# EAGLE design pripravek (EAGLE 7.2.0)
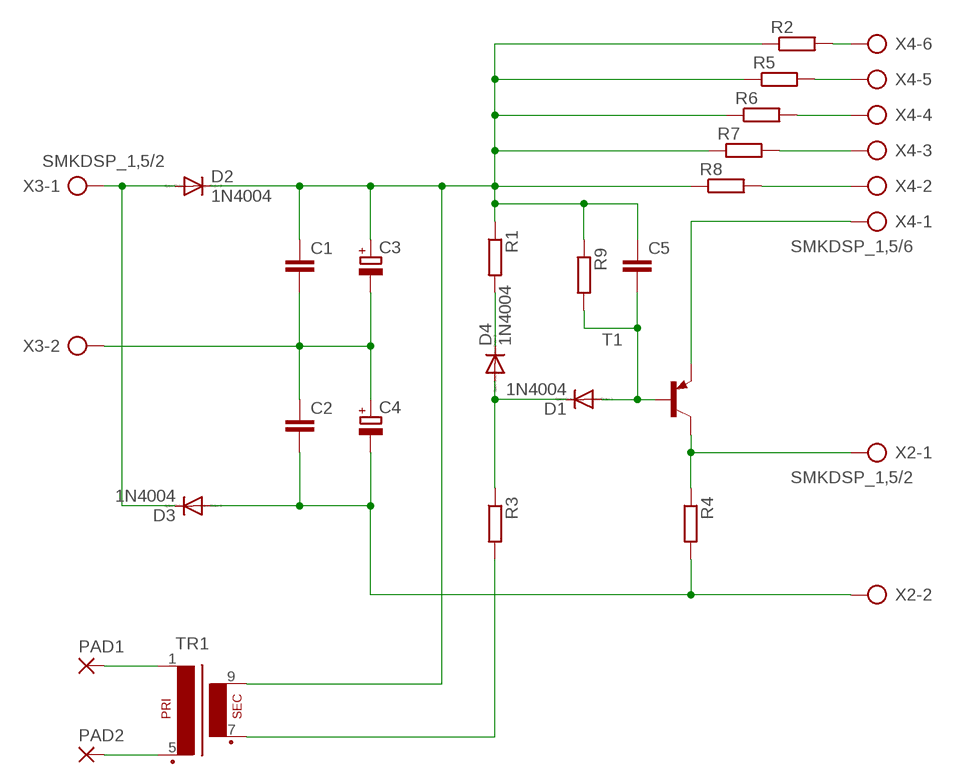
[diagram p0: schematic, sheet 1]

## Parts
C1  C-EU050-035X075  [C050-035X075]
C2  C-EU050-035X075  [C050-035X075]
C3  CPOL-EUE5-8.5  [E5-8,5]
C4  CPOL-EUE5-8.5  [E5-8,5]
C5  C-EU050-035X075  [C050-035X075]
D1  1N4004  [DO41-10]
D2  1N4004  [DO41-10]
D3  1N4004  [DO41-10]
D4  1N4004  [DO41-10]
PAD1  3,81/1,3  [3,81/1,3]
PAD2  3,81/1,3  [3,81/1,3]
R1  R-EU_0207/12  [0207/12]
R2  R-EU_0411/15  [0411/15]
R3  R-EU_0207/12  [0207/12]
R4  R-EU_0207/12  [0207/12]
R5  R-EU_0411/15  [0411/15]
R6  R-EU_0411/15  [0411/15]
R7  R-EU_0411/15  [0411/15]
R8  R-EU_0411/15  [0411/15]
R9  R-EU_0207/12  [0207/12]
T1  -PNP-TO220V  [TO220V]
TR1  EI30-1  [EI30-1]
X2  SMKDSP_1,5/2  [SMKDSP_1,5/2]
X3  SMKDSP_1,5/2  [SMKDSP_1,5/2]
X4  SMKDSP_1,5/6  [SMKDSP_1,5/6]

## Nets
BASE: C5.2 D1.A R9.2 T1.1(B)
COLECTOR: R4.1 T1.2(C) X2.1
EMITER: T1.3(E) X4.1
N$1: PAD1.1(P) TR1.1
N$2: PAD2.1(P) TR1.5(P2)
N$3: R2.2 X4.6
N$4: D1.C D4.A R3.1
N$5: C1.2 C2.1 C3.- C4.+ X3.2
N$6: D4.C R1.2
N$7: D2.A D3.C X3.1
N$8: C2.2 C4.- D3.A R4.2 X2.2
N$10: R3.2 TR1.7(S3)
N$12: R5.2 X4.5
N$13: C1.1 C3.+ C5.1 D2.C R1.1 R2.1 R5.1 R6.1 R7.1 R8.1 R9.1 TR1.9(S4)
N$14: R6.2 X4.4
N$15: R7.2 X4.3
N$16: R8.2 X4.2

## Library data of the parts
C1 C2 C5 = rcl:C-EU: CAPACITOR, European symbol
C3 C4 = rcl:CPOL-EU: POLARIZED CAPACITOR, European symbol
D1-D4 = diode:1N4004: DIODE general purpose rectifier, 1 A
PAD1 PAD2 = wirepad:3,81/1,3: THROUGH-HOLE PAD
R1-R9 = rcl:R-EU_: RESISTOR, European symbol
T1 = transistor:*-PNP-: PNP Transistror
TR1 = trafo:EI30-1: TRANSFORMER 1 primary winding, 1 secondary winding ERA
X2 X3 = con-phoenix-smkdsp:SMKDSP_1,5/2: Printklemme, Nennstrom: 17,5 A, Bemessungsspannung: 250 V, Raster: 5,0 mm Source: http://eshop.phoenixcontact.de .. 1733415.pdf; MF: FARNELL; MPN: 1733570; OC_FARNELL: 3041244; OC_NEWARK: 69C8588
X4 = con-phoenix-smkdsp:SMKDSP_1,5/6: Printklemme, Nennstrom: 17,5 A, Bemessungsspannung: 250 V, Raster: 5,0 mm Source: http://eshop.phoenixcontact.de .. 1733415.pdf; MF: FARNELL; MPN: 1733619; OC_FARNELL: 3041270; OC_NEWARK: 71C4132

## Board
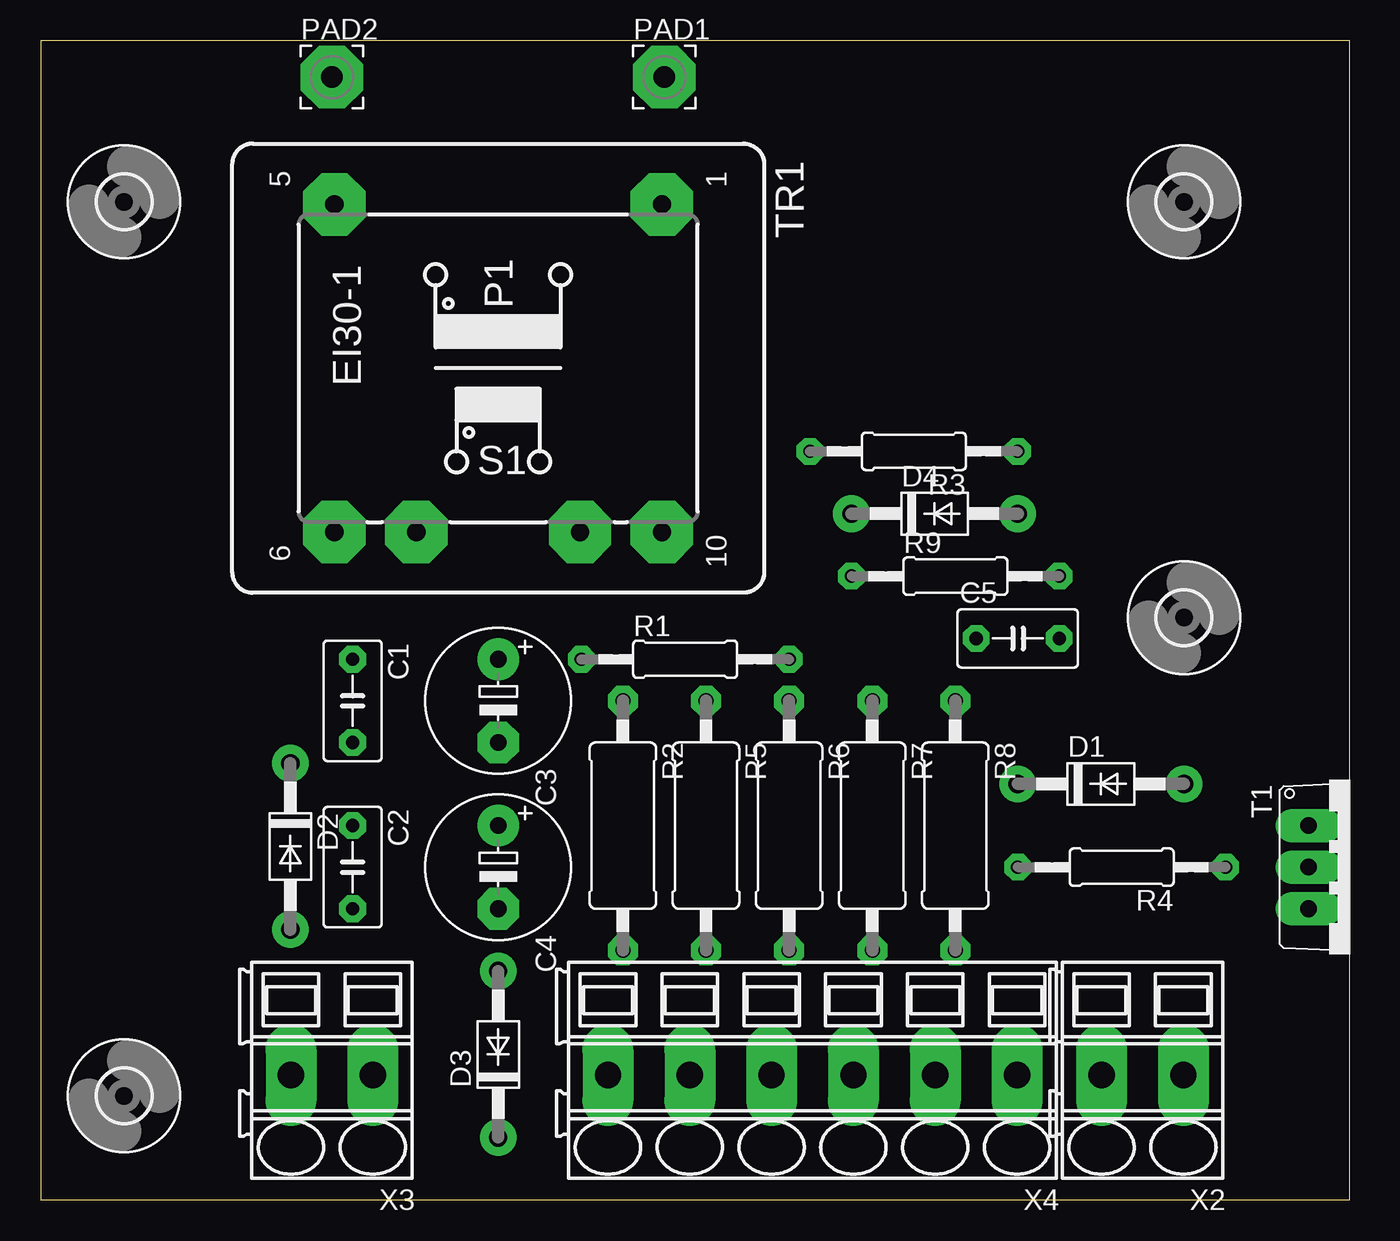
[diagram p1: board, top side]
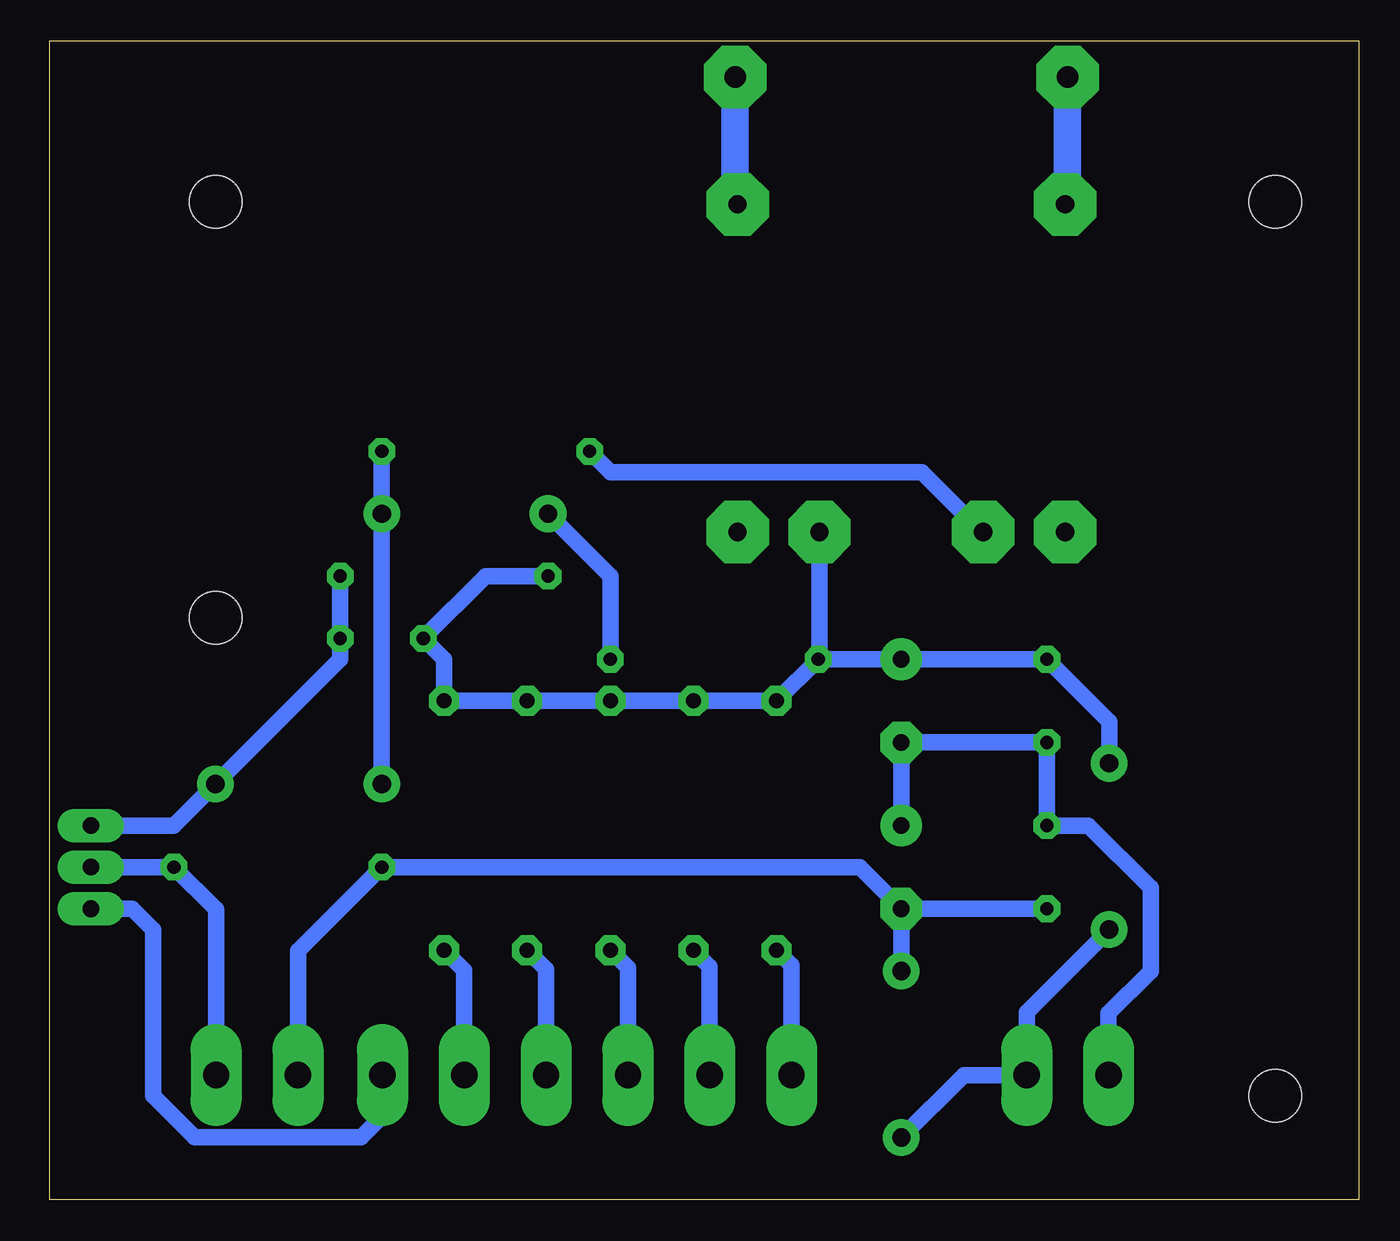
[diagram p2: board, bottom side, seen from below]

Size 79.99 x 70.79 mm. Coordinates in mm from the lower left corner, seen from the top.
Outline: 0,0 79.99,0 79.99,70.79 0,70.79 0,0
Copper layers (1*16): Top 0.035mm / dielectric 1.5mm / Bottom 0.035mm
Design rules "default *": minimum track width 10mil, minimum drill 24mil, track to track 8mil, track to pad 8mil, pad to pad 8mil, via to via 8mil, smd to smd 8mil, copper to edge 40mil, drill to drill 8mil, minimum pad ring 10mil, minimum via ring 8mil, stop-mask expansion 4mil, vias tented up to drill 0mil, thermal gap 10mil

### Footprints (pad centres in the part's own frame; a part is rotated, then mirrored left to right if it is on the bottom)
C050-035X075 = drill 0.813 octagon: 1 -2.54,0; 2 2.54,0
E5-8,5 = drill 1.016 pad 2.54: + -2.54,0 | drill 1.016 pad 2.54 octagon: - 2.54,0
DO41-10 = drill 1.118: A 5.08,0; C -5.08,0
3,81/1,3 = drill 1.321 pad 3.81 octagon: 1 0,0
0207/12 = drill 0.813 octagon: 1 -6.35,0; 2 6.35,0
0411/15 = drill 0.914 octagon: 1 -7.62,0; 2 7.62,0
TO220V = drill 1.016 long: 1 -2.54,-2.54; 2 0,-2.54; 3 2.54,-2.54
EI30-1 = drill 1.118 pad 3.81 octagon: 1 -10.008,10.008; 5 -10.008,-10.008; 6 10.008,-10.008; 7 10.008,-5.004; 9 10.008,5.004; 10 10.008,10.008
3,2 = hole 3.2: 0,0
SMKDSP_1,5/2 = drill 1.6 pad 1.8 long: 1 -2.5,0; 2 2.5,0
SMKDSP_1,5/6 = drill 1.6 pad 1.8 long: 1 -2.5,0; 2 2.5,0; 3 7.5,0; 4 12.5,0; 5 17.5,0; 6 22.5,0

### Placement (x,y rotation side)
C1  19.05,30.48 270 top
C2  19.05,20.32 270 top
C3  27.94,30.48 270 top
C4  27.94,20.32 270 top
C5  59.69,34.29 0 top
D1  64.77,25.4 0 top
D2  15.24,21.59 270 top
D3  27.94,8.89 90 top
D4  54.61,41.91 0 top
PAD1  38.1,68.58 0 top
PAD2  17.78,68.58 0 top
R1  39.37,33.02 0 top
R2  35.56,22.86 270 top
R3  53.34,45.72 180 top
R4  66.04,20.32 180 top
R5  40.64,22.86 270 top
R6  45.72,22.86 270 top
R7  50.8,22.86 270 top
R8  55.88,22.86 270 top
R9  55.88,38.1 0 top
T1  80.01,20.32 270 top
TR1  27.94,50.8 270 top
U$1  [3,2]  5.08,60.96 0 top
U$2  [3,2]  5.08,6.35 0 top
U$3  [3,2]  69.85,60.96 0 top
U$4  [3,2]  69.85,35.56 0 top
X2  67.31,7.62 180 top
X3  17.78,7.62 180 top
X4  57.15,7.62 180 top

### Tracks (layer width: path | path; a pad name or v marks a point on that pad's centre or on a via)
BASE
  Bottom 1.016: T1.1 72.39,22.86 D1.A 62.23,33.02 C5.2 R9.2
COLECTOR
  Bottom 1.016: X2.1 69.81,17.74 R4.1 T1.2
EMITER
  Bottom 1.016: X4.1 59.65,5.12 60.96,3.81 71.12,3.81 73.66,6.35 73.66,16.51 74.93,17.78 T1.3
N$1
  Bottom 1.676: PAD1.1 38.1,60.96 TR1.1
N$2
  Bottom 1.676: PAD2.1 17.78,60.96 TR1.5
N$3
  Bottom 1.016: X4.6 34.65,14.33 R2.2
N$4
  Bottom 1.016: D1.C D4.A R3.1
N$5
  Bottom 1.016: C4.+ C3.- C1.2 C2.1 16.51,22.86 12.7,19.05 12.7,13.97 15.28,11.39 X3.2
N$6
  Bottom 1.016: R1.2 45.72,38.1 D4.C
N$7
  Bottom 1.016: D2.A 20.28,11.47 X3.1 24.13,7.62 D3.C
N$8
  Bottom 1.016: C2.2 C4.- | D3.A C4.- | C4.- 30.48,20.32 R4.2 64.81,15.2 X2.2
N$10
  Bottom 1.016: TR1.7 23.01,40.79 26.67,44.45 45.72,44.45 R3.2
N$12
  Bottom 1.016: X4.5 39.65,14.25 R5.2
N$13
  Bottom 1.016: R1.1 C3.+ C1.1 15.24,29.21 D2.C | TR1.9 32.94,33.1 R1.1 | R9.1 53.34,38.1 C5.1 55.88,33.02 R8.1 R7.1 R6.1 R5.1 R2.1 R1.1
N$14
  Bottom 1.016: X4.4 44.65,14.17 R6.2
N$15
  Bottom 1.016: X4.3 49.65,14.09 R7.2
N$16
  Bottom 1.016: X4.2 54.65,14.01 R8.2